# Altium project 24.WatchX2_Shellless.PrjPcb
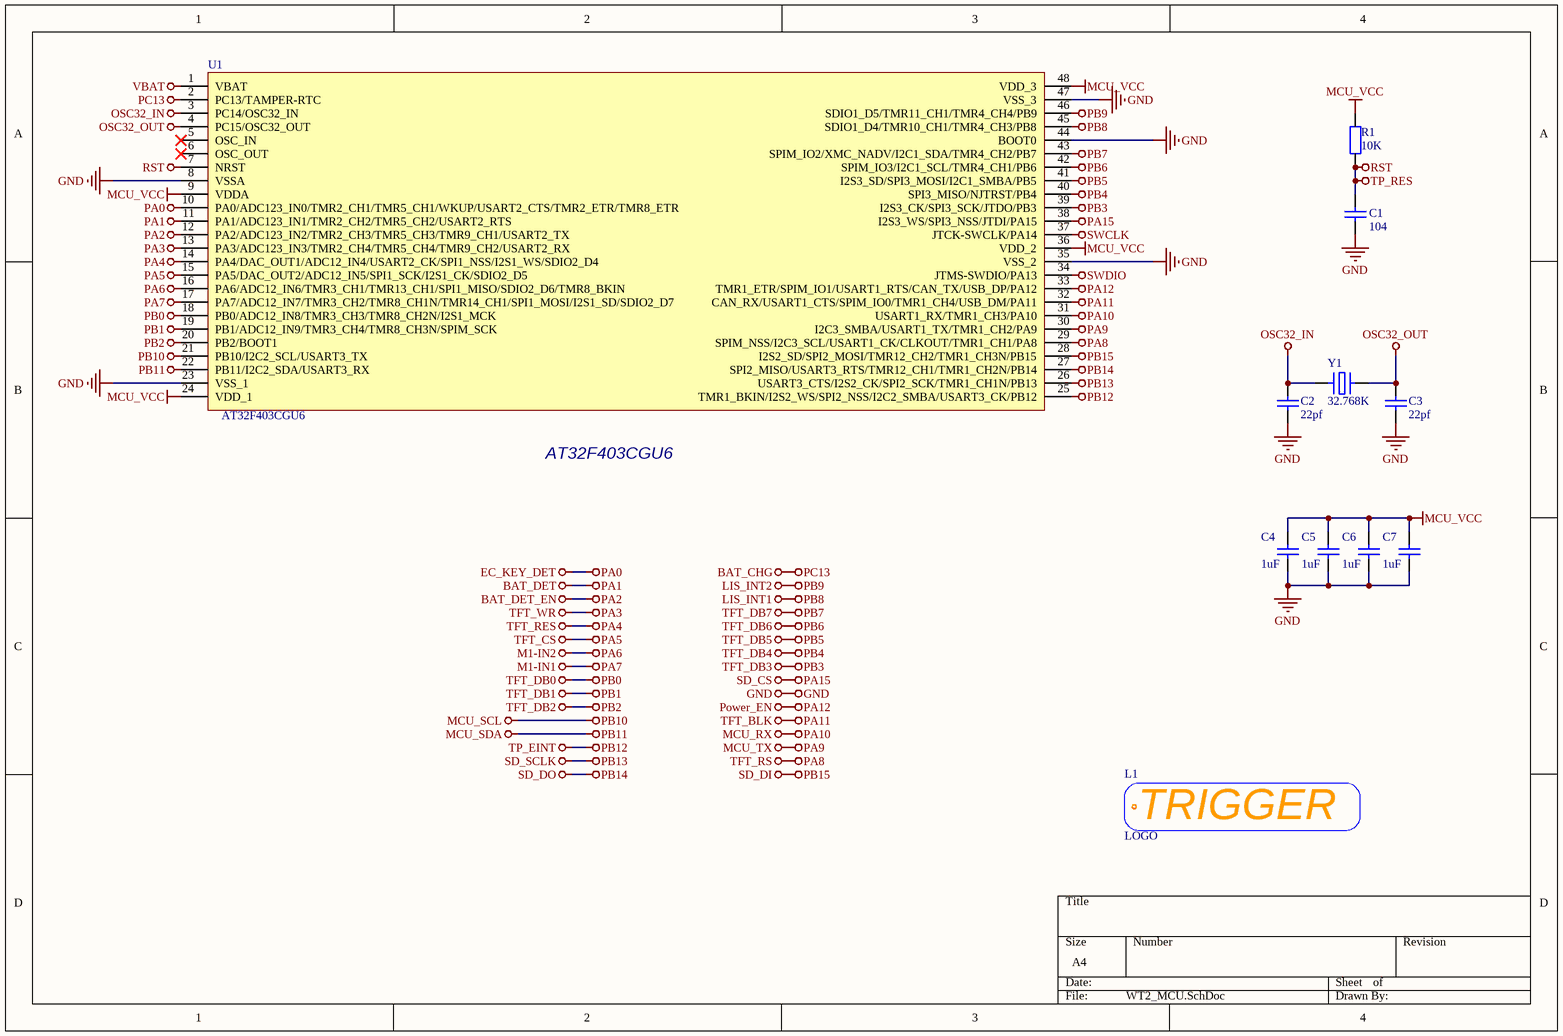
[diagram p0: WT2_MCU.SchDoc]
6 sheets, 87 parts. Net scope: global (net labels, ports and power ports of the same name join across sheets).
Board file: WT2_SL.PcbDoc
Sheets:
  WT2_MCU.SchDoc
  WT2_Ports.SchDoc
  WT2_Power.SchDoc
  WT2_Screen.SchDoc
  WT2_Sensors.SchDoc
  WT2_Slave.SchDoc

## Sheet WT2_MCU.SchDoc
size A4

### Parts
C1  104  [电容_C0402]
C2  22pf  [电容_C0402]
C3  22pf  [电容_C0402]
C4  1uF  [电容_C0402]
C5  1uF  [电容_C0402]
C6  1uF  [电容_C0402]
C7  1uF  [电容_C0402]
L1  LOGO  [LOGO REV L BS]
R1  10K  [电阻_R0402]
U1  AT32F403CGU6  [AT主控_QFN48(6X6)]
Y1  32.768K  [晶振_3215]

### Nets
BAT_CHG: U1.2(PC13/TAMPER-RTC)  [also labelled PC13]
BAT_DET: U1.11(PA1/ADC123_IN1/TMR2_CH2/TMR5_CH2/USART2_RTS)  [also labelled PA1]
BAT_DET_EN: U1.12(PA2/ADC123_IN2/TMR2_CH3/TMR5_CH3/TMR9_CH1/USART2_TX)  [also labelled PA2]
EC_KEY_DET: U1.10(PA0/ADC123_IN0/TMR2_CH1/TMR5_CH1/WKUP/USART2_CTS/TMR2_ETR/TMR8_ETR)  [also labelled PA0]
GND: C1.1 C2.2 C3.2 C4.1 C5.1 C6.1 C7.1 U1.0(VSS) U1.8(VSSA) U1.23(VSS_1) U1.35(VSS_2) U1.44(BOOT0) U1.47(VSS_3)
LIS_INT1: U1.45(SDIO1_D4/TMR10_CH1/TMR4_CH3/PB8)  [also labelled PB8]
LIS_INT2: U1.46(SDIO1_D5/TMR11_CH1/TMR4_CH4/PB9)  [also labelled PB9]
M1-IN1: U1.17(PA7/ADC12_IN7/TMR3_CH2/TMR8_CH1N/TMR14_CH1/SPI1_MOSI/I2S1_SD/SDIO2_D7)  [also labelled PA7]
M1-IN2: U1.16(PA6/ADC12_IN6/TMR3_CH1/TMR13_CH1/SPI1_MISO/SDIO2_D6/TMR8_BKIN)  [also labelled PA6]
MCU_RX: U1.31(USART1_RX/TMR1_CH3/PA10)  [also labelled PA10]
MCU_SCL: U1.21(PB10/I2C2_SCL/USART3_TX)  [also labelled PB10]  [project net ASCL]
MCU_SDA: U1.22(PB11/I2C2_SDA/USART3_RX)  [also labelled PB11]  [project net ASDA]
MCU_TX: U1.30(I2C3_SMBA/USART1_TX/TMR1_CH2/PA9)  [also labelled PA9]
MCU_VCC: C4.2 C5.2 C6.2 C7.2 R1.2 U1.9(VDDA) U1.24(VDD_1) U1.36(VDD_2) U1.48(VDD_3)  [project net 3V3]
OSC32_IN: C2.1 U1.3(PC14/OSC32_IN) Y1.1
OSC32_OUT: C3.1 U1.4(PC15/OSC32_OUT) Y1.2
PA3: U1.13(PA3/ADC123_IN3/TMR2_CH4/TMR5_CH4/TMR9_CH2/USART2_RX)  [also labelled TFT_WR]
PA4: U1.14(PA4/DAC_OUT1/ADC12_IN4/USART2_CK/SPI1_NSS/I2S1_WS/SDIO2_D4)  [also labelled TFT_RES]
PA5: U1.15(PA5/DAC_OUT2/ADC12_IN5/SPI1_SCK/I2S1_CK/SDIO2_D5)  [also labelled TFT_CS]
PA8: U1.29(SPIM_NSS/I2C3_SCL/USART1_CK/CLKOUT/TMR1_CH1/PA8)  [also labelled TFT_RS]
PA11: U1.32(CAN_RX/USART1_CTS/SPIM_IO0/TMR1_CH4/USB_DM/PA11)  [also labelled TFT_BLK]
PA12: U1.33(TMR1_ETR/SPIM_IO1/USART1_RTS/CAN_TX/USB_DP/PA12)  [also labelled Power_EN]
PB0: U1.18(PB0/ADC12_IN8/TMR3_CH3/TMR8_CH2N/I2S1_MCK)  [also labelled TFT_DB0]
PB1: U1.19(PB1/ADC12_IN9/TMR3_CH4/TMR8_CH3N/SPIM_SCK)  [also labelled TFT_DB1]
PB2: U1.20(PB2/BOOT1)  [also labelled TFT_DB2]
PB3: U1.39(I2S3_CK/SPI3_SCK/JTDO/PB3)  [also labelled TFT_DB3]
PB4: U1.40(SPI3_MISO/NJTRST/PB4)  [also labelled TFT_DB4]
PB5: U1.41(I2S3_SD/SPI3_MOSI/I2C1_SMBA/PB5)  [also labelled TFT_DB5]
PB6: U1.42(SPIM_IO3/I2C1_SCL/TMR4_CH1/PB6)  [also labelled TFT_DB6]
PB7: U1.43(SPIM_IO2/XMC_NADV/I2C1_SDA/TMR4_CH2/PB7)  [also labelled TFT_DB7]
PB12: U1.25(TMR1_BKIN/I2S2_WS/SPI2_NSS/I2C2_SMBA/USART3_CK/PB12)  [also labelled TP_EINT]
RST: C1.2 R1.1 U1.7(NRST)  [also labelled TP_RES]
SD_CS: U1.38(I2S3_WS/SPI3_NSS/JTDI/PA15)  [also labelled PA15]
SD_DI: U1.28(I2S2_SD/SPI2_MOSI/TMR12_CH2/TMR1_CH3N/PB15)  [also labelled PB15]
SD_DO: U1.27(SPI2_MISO/USART3_RTS/TMR12_CH1/TMR1_CH2N/PB14)  [also labelled PB14]
SD_SCLK: U1.26(USART3_CTS/I2S2_CK/SPI2_SCK/TMR1_CH1N/PB13)  [also labelled PB13]
SWCLK: U1.37(JTCK-SWCLK/PA14)
SWDIO: U1.34(JTMS-SWDIO/PA13)
VBAT: U1.1(VBAT)

Not connected (* = marked no-connect by the designer): U1 5(OSC_IN)* 6(OSC_OUT)*

### Notes on the sheet
- (near U1) AT32F403CGU6
- (in symbol LOGO_TRIGGER) TRIGGER

### Library data of the parts
C1-C7 = cap: U: 50V; 参数: Cap,0805,X7R,104K,50V,125C,±10%
  C1: C: 104
  C2 C3: C: 22pf
  C4-C7: C: 1uF
L1 = LOGO_TRIGGER
R1 = Res: P: 1/8W; 参数: Res,0805,0R,±1%,1/8W,100ppm,155C; R: 10K
U1 = AT32F403CGU6: _Footprint: QFN48; _Comma: ,; _Name: MCU; _Specification: MCU,AT32F403CGU6,QFN48; _Model: AT32F403CGU6
Y1 = XTAL_A: _Name: CRYSTALS; _Comma: ,; _Specification: CRYSTALS,32.768K,*,10ppm,12pF; _Accuracy: 10ppm; _CL: 12pF; _Footprint: *; _Frequency: 32.768K

## Sheet WT2_Ports.SchDoc
size A4
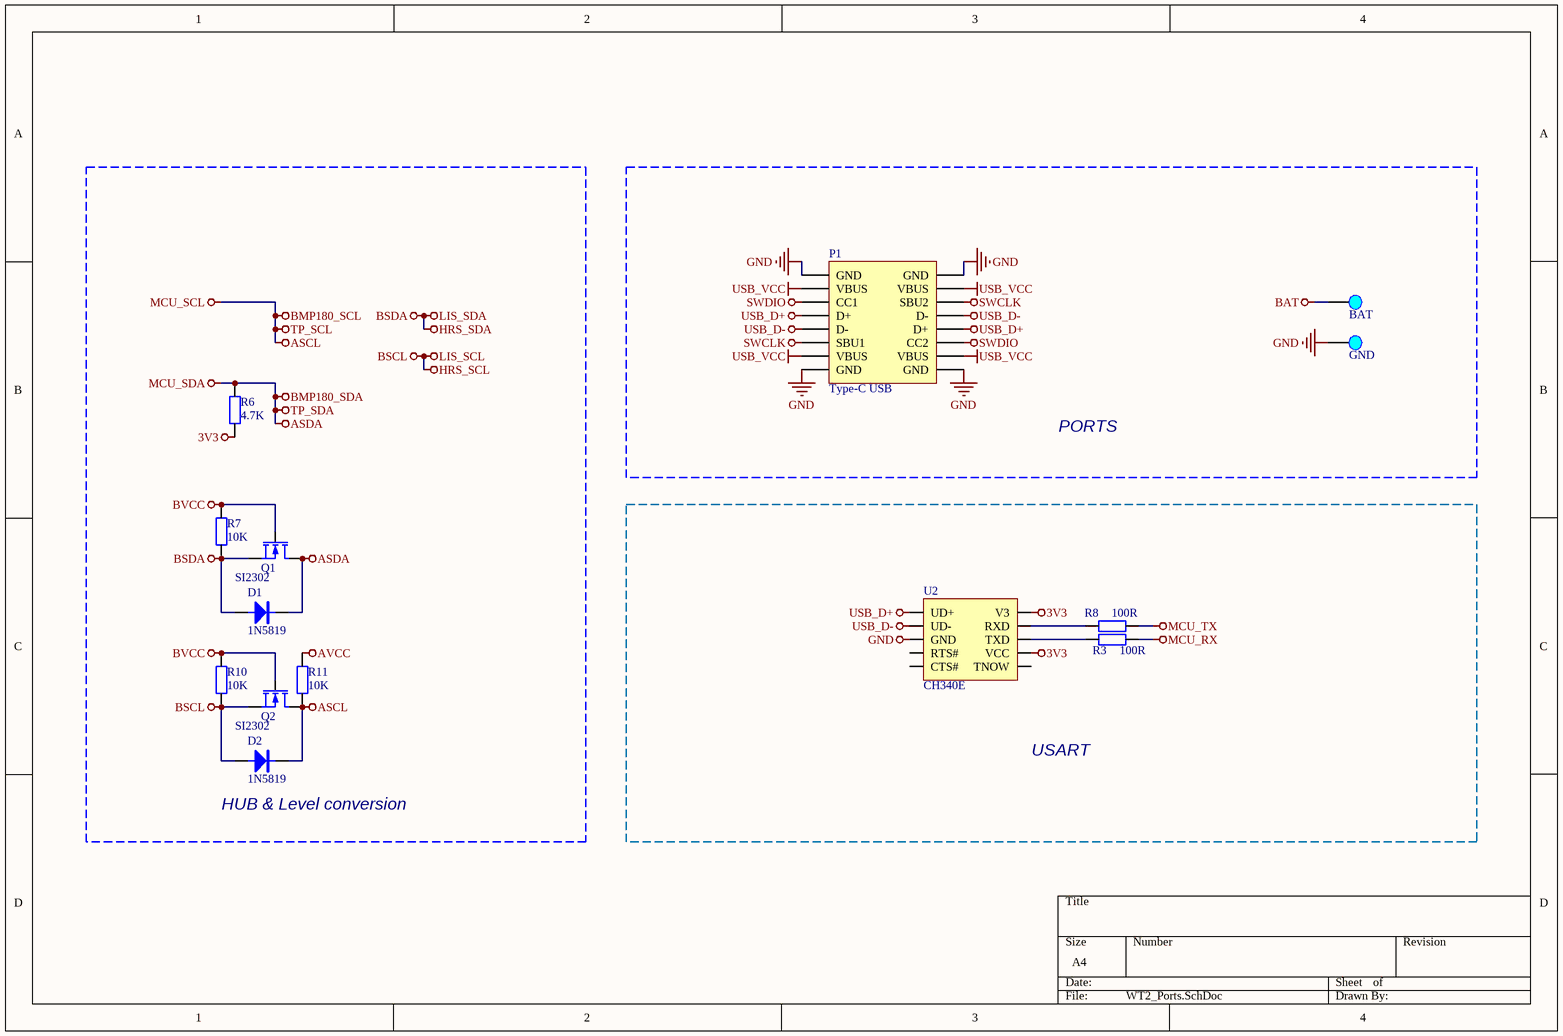
[diagram p1: WT2_Ports.SchDoc]

### Parts
D1  1N5819  [二极管_SOD-323]
D2  1N5819  [二极管_SOD-323]
P1  Type-C USB  [Type-C_16P]
Pad2  BAT  [Pad_A]
Pad4  GND  [Pad_A]
Q1  SI2302  [MOS_SOT-23]
Q2  SI2302  [MOS_SOT-23]
R3  100R  [电阻_R0402]
R6  4.7K  [电阻_R0402]
R7  10K  [电阻_R0402]
R8  100R  [电阻_R0402]
R10  10K  [电阻_R0402]
R11  10K  [电阻_R0402]
U2  CH340E  [MSOP10]

### Blocks framed on the sheet
HUB & Level conversion: D1 D2 Q1 Q2 R6 R7 R10 R11
PORTS: P1 Pad2 Pad4
USART: R3 R8 U2

### Nets
3V3: R6.1 R11.1 U2.7(VCC) U2.10(V3)  [also labelled AVCC]
ASCL: D2.K Q2.2(D) R11.2  [also labelled BMP180_SCL, MCU_SCL, TP_SCL]
ASDA: D1.K Q1.2(D) R6.2  [also labelled BMP180_SDA, MCU_SDA, TP_SDA]
BAT: Pad2.1
BSCL: D2.A Q2.3(S) R10.2  [also labelled HRS_SCL, LIS_SCL]
BSDA: D1.A Q1.3(S) R7.2  [also labelled HRS_SDA, LIS_SDA]
BVCC: Q1.1(G) Q2.1(G) R7.1 R10.1  [project net 1.8V]
GND: P1.0(GND) P1.A1(GND) P1.A12(GND) P1.B1(GND) P1.B12(GND) Pad4.1 U2.3(GND)
MCU_RX: R3.1
MCU_TX: R8.1
SWCLK: P1.A8(SBU1) P1.B8(SBU2)
SWDIO: P1.A5(CC1) P1.B5(CC2)
USB_D+: P1.A6(D+) P1.B6(D+) U2.1(UD+)
USB_D-: P1.A7(D-) P1.B7(D-) U2.2(UD-)
USB_VCC: P1.A4(VBUS) P1.A9(VBUS) P1.B4(VBUS) P1.B9(VBUS)
NetR3_2: R3.2 U2.8(TXD)
NetR8_2: R8.2 U2.9(RXD)

Not connected (* = marked no-connect by the designer): U2 4(RTS#) 5(CTS#) 6(TNOW)

### Library data of the parts
D1 D2 = Diode: _Specification: Diode,1N5819,SOD-323,1A,40V; _Comma: ,; _Footprint: SOD-323; _Voltage: 40V; _Current: 1A; _Name: Diode; _Model: 1N5819
P1 = Type-C USB Easy 16PIN: _Comma: ,; _Name: Port; _Specification: Port,Type-C USB,16PIN; _Value: 16PIN; _Model: Type-C USB
Pad2 = Pad: _Funcyusa: Test; _Specification: Pad,Test,BAT; _Comma: ,; _Name: Pad; _Remarks: BAT
Pad4 = Pad: _Funcyusa: Test; _Specification: Pad,Test,GND; _Comma: ,; _Name: Pad; _Remarks: GND
Q1 Q2 = MOSFET-N: _Comma: ,; _Current: 150A; _Footprint: DFN5*6; _Name: N-MOSFET; _Specification: N-MOSFET,SI2302,DFN5*6,150A,30V; _Voltage: 30V; _Model: SI2302
R3 R6-R8 R10 R11 = Res: as R1 on sheet WT2_MCU
  R3 R8: R: 100R
  R6: R: 4.7K
  R7 R10 R11: R: 10K

## Sheet WT2_Power.SchDoc
size A4
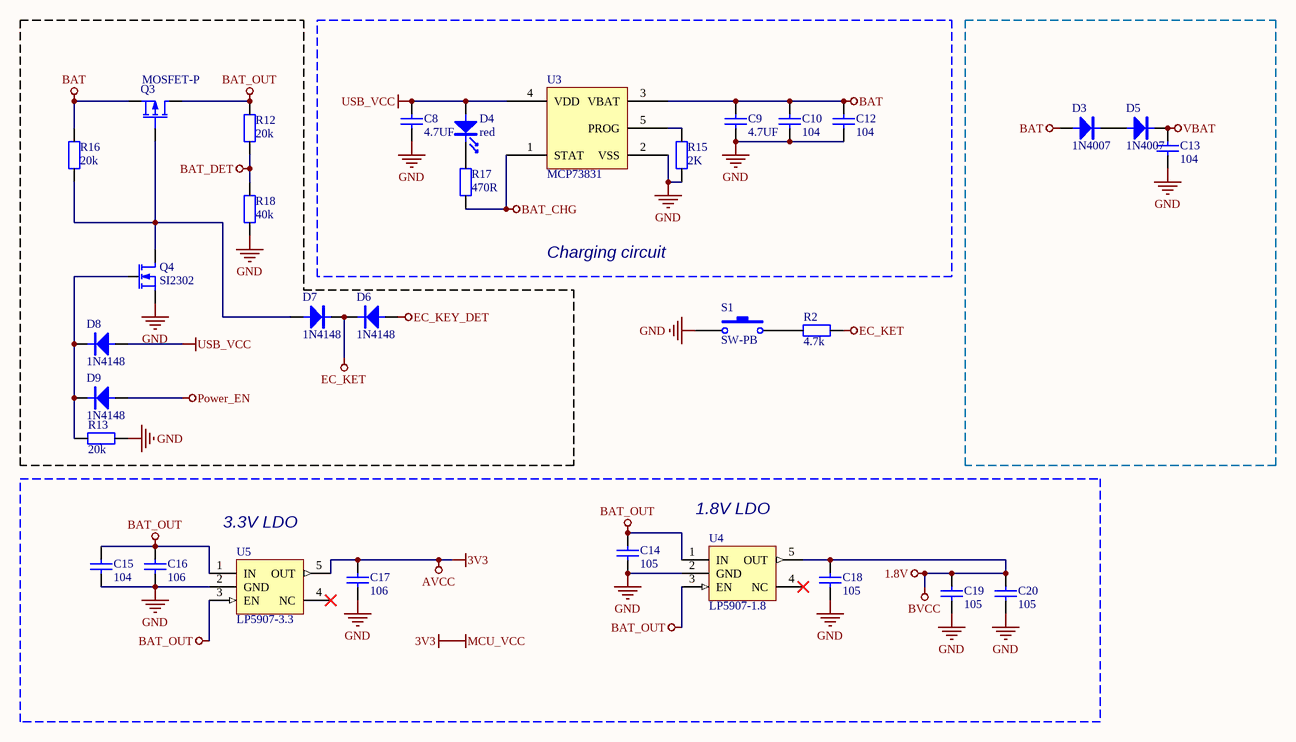
[diagram p2: WT2_Power.SchDoc]

### Parts
(Parts that share a designator on the sheet are numbered #1, #2 ... from top to bottom, then left to right.)
C8  4.7UF  [电容_C0805]
C9  4.7UF  [电容_C0805]
C10  104  [电容_C0402]
C12  104  [电容_C0402]
C13  104  [电容_C0402]
C14  105  [电容_C0402]
C15  104  [电容_C0402]
C16  106  [电容_C0603]
C17  106  [电容_C0603]
C18  105  [电容_C0402]
C19  105  [电容_C0402]
C20  105  [电容_C0402]
D3  1N4007  [二极管_SOD-323]
D4  red  [LED_0603]
D5  1N4007  [二极管_SOD-323]
D6  1N4148  [二极管_SOD-323]
D7  1N4148  [二极管_SOD-323]
D8  1N4148  [二极管_SOD-323]
D9  1N4148  [二极管_SOD-323]
Q3  MOSFET-P  [SOT23]
Q4#1  SI2302  [MOS_SOT-23]
R2  4.7k  [电阻_R0402]
R12  20k  [电阻_R0402]
R13  20k  [电阻_R0402]
R15  2K  [电阻_R0402]
R16  20k  [电阻_R0402]
R17  470R  [电阻_R0402]
R18  40k  [电阻_R0402]
S1  SW-PB  [KEY-TE26EA]
U3  MCP73831  [SOT23-5]
U4  LP5907-1.8  [SOT23-5]
U5  LP5907-3.3  [SOT23-5]

### Blocks framed on the sheet
Charging circuit: C8-C10 C12 D4 R15 R17 U3

### Nets
1.8V: C18.2 C19.2 C20.2 U4.5(OUT)  [also labelled BVCC]
3V3: C17.2 U5.5(OUT)  [also labelled AVCC, MCU_VCC]
BAT: C9.2 C10.1 C12.1 D3.A Q3.3(S) R16.2 U3.3(VBAT)
BAT_CHG: R17.1 U3.1(STAT)
BAT_DET: R12.1 R18.2
BAT_OUT: C14.2 C15.2 C16.2 Q3.2(D) R12.2 U4.1(IN) U4.3(EN) U5.1(IN) U5.3(EN)
EC_KET: D6.K D7.K R2.1
EC_KEY_DET: D6.A
GND: C8.1 C9.1 C10.2 C12.2 C13.2 C14.1 C15.1 C16.1 C17.1 C18.1 C19.1 C20.1 Q4#1.3(S) R13.1 R15.1 R18.1 S1.1 U3.2(VSS) U4.2(GND) U5.2(GND)
Power_EN: D9.A  [project net PA12]
USB_VCC: C8.2 D4.A D8.A U3.4(VDD)
VBAT: C13.1 D5.K
NetD3_K: D3.K D5.A
NetD4_K: D4.K R17.2
NetD7_A: D7.A Q3.1(G) Q4#1.2(D) R16.1
NetD8_K: D8.K D9.K Q4#1.1(G) R13.2
NetR2_2: R2.2 S1.2
NetR15_2: R15.2 U3.5(PROG)

Not connected (* = marked no-connect by the designer): U4 4(NC)*; U5 4(NC)*

### Notes on the sheet
- (near U5) 3.3V LDO
- (near U4) 1.8V LDO

### Library data of the parts
C8-C10 C12-C20 = cap: as C1 on sheet WT2_MCU
  C8 C9: C: 4.7UF
  C10 C12 C13 C15: C: 104
  C14 C18-C20: C: 105
  C16 C17: C: 106
D3 D5 = Diode: _Specification: Diode,1N4007,SOD-323,1A,40V; _Comma: ,; _Footprint: SOD-323; _Voltage: 40V; _Current: 1A; _Name: Diode; _Model: 1N4007
D4 = LED: 参数: LED,0603,Red
D6-D9 = Diode: _Specification: Diode,1N4148,SOD-323,1A,40V; _Comma: ,; _Footprint: SOD-323; _Voltage: 40V; _Current: 1A; _Name: Diode; _Model: 1N4148
Q3 = MOSFET-P: P-Channel MOSFET; Published: 8-Jun-2000; LatestRevisionDate: 17-Jul-2002; LatestRevisionNote: Re-released for DXP Platform.; PackageVersion: 1995/1996; PackageReference: E3; Publisher: Altium Limited; PackageDescription: TO, Flat Index; 3 In-Line, Axial Leads; Body Dia. 4.6mm; Lead Dia. 0.5 mm (max)
Q4#1 = MOSFET-N: as Q1 on sheet WT2_Ports; _Model: SI2302
R2 R12 R13 R15-R18 = Res: as R1 on sheet WT2_MCU
  R2: R: 4.7k
  R12 R13 R16: R: 20k
  R15: R: 2K
  R17: R: 470R
  R18: R: 40k
S1 = SW-PB: 按键
U3 = MCP73831: 线性充电管理控制器
U4 U5 = LP5907: LDO

## Sheet WT2_Screen.SchDoc
size A4
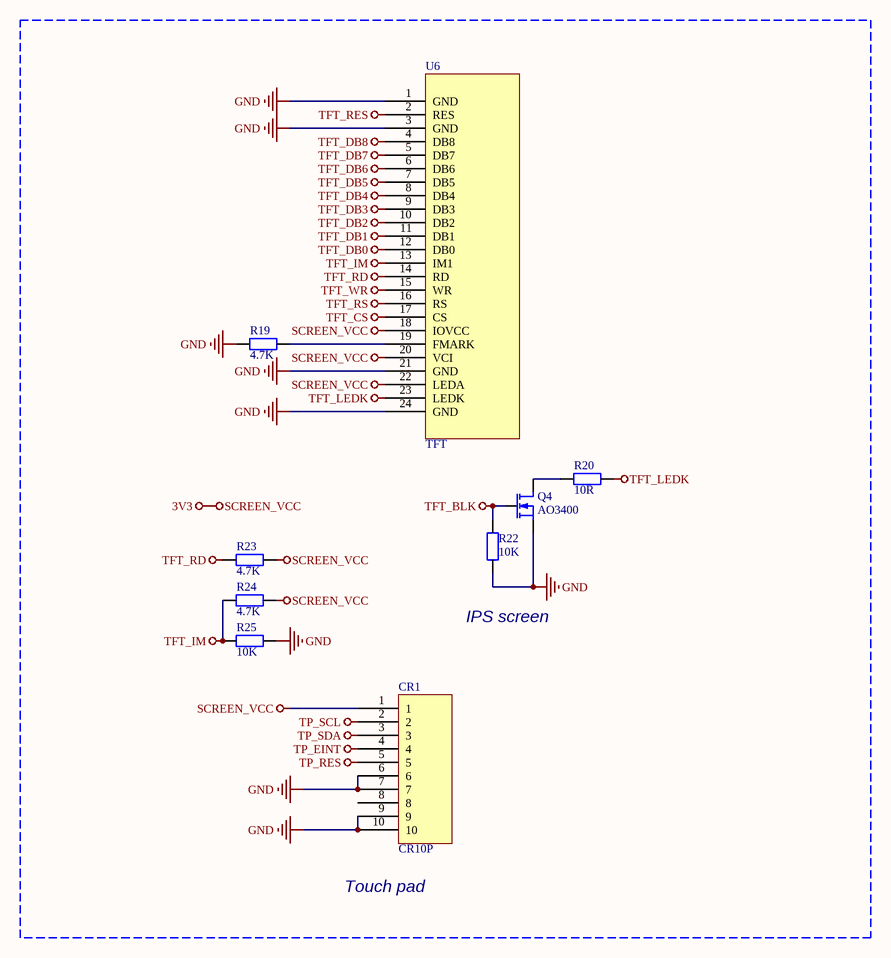
[diagram p3: WT2_Screen.SchDoc]

### Parts
(Parts that share a designator on the sheet are numbered #1, #2 ... from top to bottom, then left to right.)
CR1  CR10P  [CONN RCPT 10POS 0.4MM]
Q4#2  AO3400  [MOS_SOT-23]
R19  4.7K  [电阻_R0402]
R20  10R  [电阻_R0402]
R22  10K  [电阻_R0402]
R23  4.7K  [电阻_R0402]
R24  4.7K  [电阻_R0402]
R25  10K  [电阻_R0402]
U6  TFT  [CONN-SMD_DF37NC-24DS-0.4V(51)]

### Nets
3V3: CR1.1 R23.2 R24.2 U6.18(IOVCC) U6.20(VCI) U6.22(LEDA)  [also labelled SCREEN_VCC]
GND: CR1.6 CR1.7 CR1.9 CR1.10 Q4#2.3(S) R19.1 R22.1 R25.1 U6.1(GND) U6.3(GND) U6.21(GND) U6.24(GND)
TFT_BLK: Q4#2.1(G) R22.2  [project net PA11]
TFT_CS: U6.17(CS)  [project net PA5]
TFT_DB0: U6.12(DB0)  [project net PB0]
TFT_DB1: U6.11(DB1)  [project net PB1]
TFT_DB2: U6.10(DB2)  [project net PB2]
TFT_DB3: U6.9(DB3)  [project net PB3]
TFT_DB4: U6.8(DB4)  [project net PB4]
TFT_DB5: U6.7(DB5)  [project net PB5]
TFT_DB6: U6.6(DB6)  [project net PB6]
TFT_DB7: U6.5(DB7)  [project net PB7]
TFT_DB8: U6.4(DB8)
TFT_IM: R24.1 R25.2 U6.13(IM1)
TFT_LEDK: R20.2 U6.23(LEDK)
TFT_RD: R23.1 U6.14(RD)
TFT_RES: U6.2(RES)  [project net PA4]
TFT_RS: U6.16(RS)  [project net PA8]
TFT_WR: U6.15(WR)  [project net PA3]
TP_EINT: CR1.4  [project net PB12]
TP_RES: CR1.5  [project net RST]
TP_SCL: CR1.2  [project net ASCL]
TP_SDA: CR1.3  [project net ASDA]
NetQ4#2_2: Q4#2.2(D) R20.1
NetR19_2: R19.2 U6.19(FMARK)

Not connected (* = marked no-connect by the designer): CR1 8

### Notes on the sheet
- (near R22) IPS screen
- (near CR1) Touch pad

### Library data of the parts
CR1 = CONN RCPT 10P: 板对板连接器
Q4#2 = MOSFET-N: _Comma: ,; _Current: 150A; _Footprint: DFN5*6; _Name: N-MOSFET; _Specification: N-MOSFET,AO3400,DFN5*6,150A,30V; _Voltage: 30V; _Model: AO3400
R19 R23 R24 = Res: _Accuracy: 1%; _Power: 1/8W; _Footprint: 0805; _Drift: 100ppm; _Comma: ,; _Specification: Res,0805,4.7K,1%,1/8W,100ppm; _Name: Res; _Value: 4.7K
R20 = Res: _Accuracy: 1%; _Power: 1/8W; _Footprint: 0805; _Drift: 100ppm; _Comma: ,; _Specification: Res,0805,10R,1%,1/8W,100ppm; _Name: Res; _Value: 10R
R22 R25 = Res: _Accuracy: 1%; _Power: 1/8W; _Footprint: 0805; _Drift: 100ppm; _Comma: ,; _Specification: Res,0805,10K,1%,1/8W,100ppm; _Name: Res; _Value: 10K
U6 = TFT_IPS_8Bit_1.54_240*240

## Sheet WT2_Sensors.SchDoc
size A4
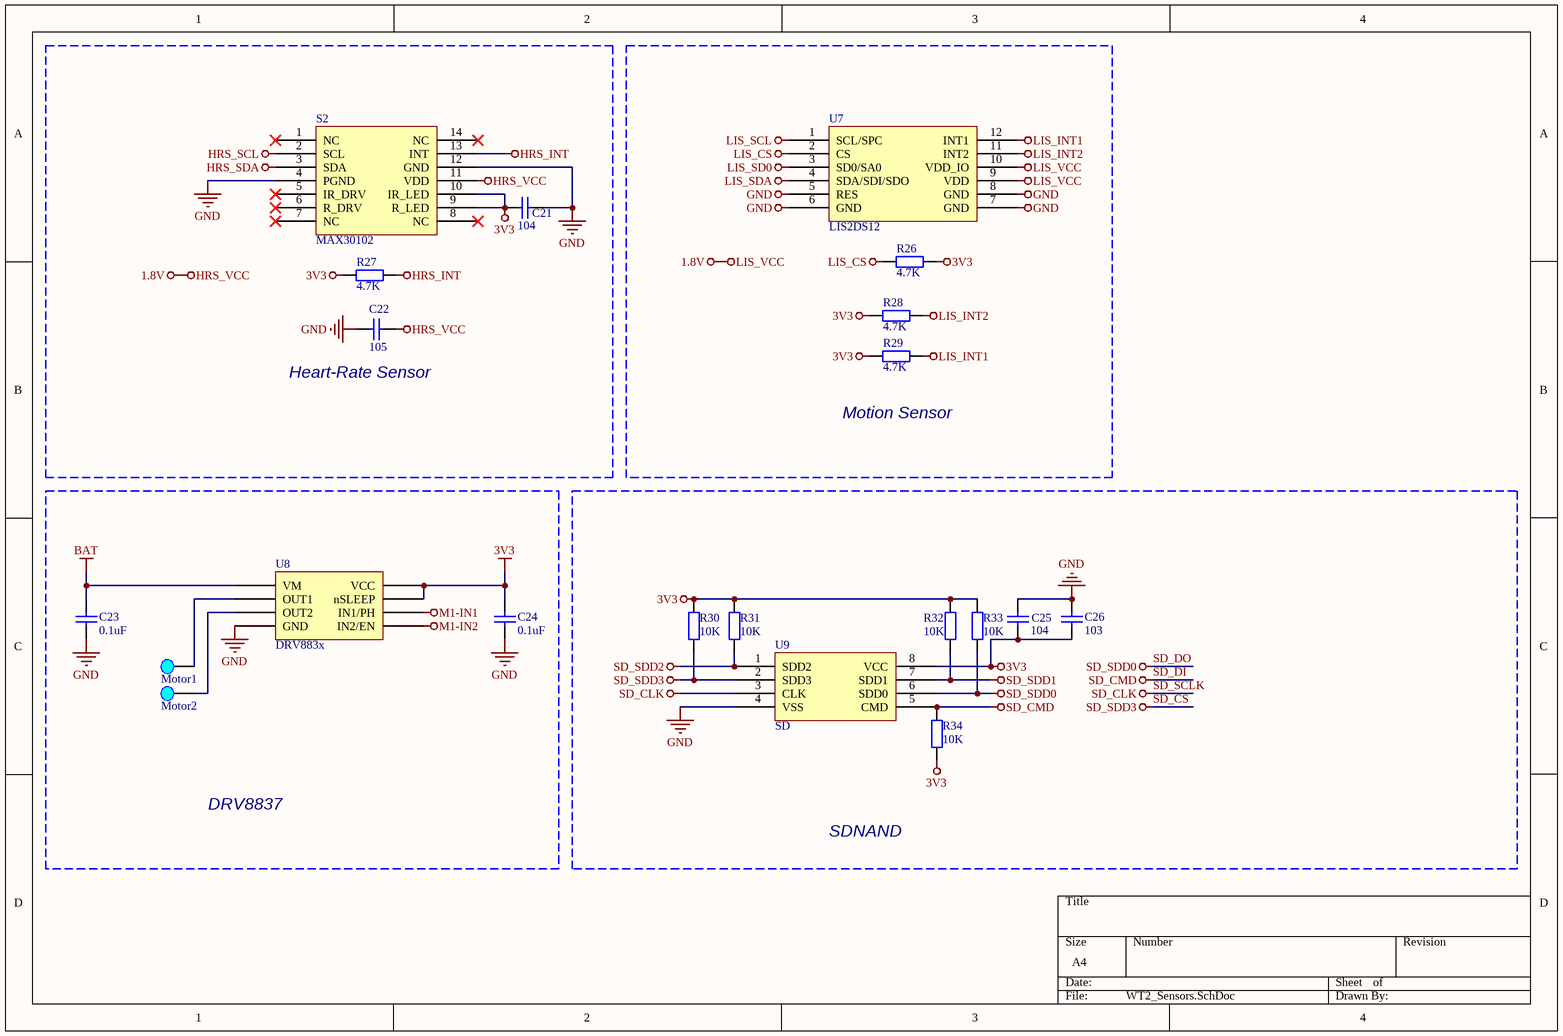
[diagram p4: WT2_Sensors.SchDoc]

### Parts
C21  104  [电容_C0402]
C22  105  [电容_C0402]
C23  0.1uF  [电容_C0402]
C24  0.1uF  [电容_C0402]
C25  104  [电容_C0402]
C26  103  [电容_C0402]
Pad7  Motor1  [Pad_A]
Pad8  Motor2  [Pad_A]
R26  4.7K  [电阻_R0402]
R27  4.7K  [电阻_R0402]
R28  4.7K  [电阻_R0402]
R29  4.7K  [电阻_R0402]
R30  10K  [电阻_R0402]
R31  10K  [电阻_R0402]
R32  10K  [电阻_R0402]
R33  10K  [电阻_R0402]
R34  10K  [电阻_R0402]
S2  MAX30102  [MAX30102]
U7  LIS2DS12  [LGA-12_2*2mm]
U8  DRV883x  [WSON-8_2*2]
U9  SD  [LGA-8_6*8mm2]

### Blocks framed on the sheet
Heart-Rate Sensor: C21 C22 R27 S2
Motion Sensor: R26 R28 R29 U7
DRV8837: C23 C24 Pad7 Pad8 U8
SDNAND: C25 C26 R30-R34 U9

### Nets
1.8V: C22.1 S2.11(VDD) U7.9(VDD) U7.10(VDD_IO)  [also labelled HRS_VCC, LIS_VCC]
3V3: C21.2 C24.2 C25.1 C26.1 R26.1 R27.2 R28.2 R29.2 R30.1 R31.1 R32.1 R33.1 R34.2 S2.9(R_LED) S2.10(IR_LED) U8.7(nSLEEP) U8.8(VCC) U9.8(VCC)
BAT: C23.1 U8.1(VM)
GND: C21.1 C22.2 C23.2 C24.1 C25.2 C26.2 S2.4(PGND) S2.12(GND) U7.5(RES) U7.6(GND) U7.7(GND) U7.8(GND) U8.4(GND) U9.4(VSS)
HRS_INT: R27.1 S2.13(INT)
HRS_SCL: S2.2(SCL) U7.1(SCL/SPC)  [also labelled LIS_SCL]  [project net BSCL]
HRS_SDA: S2.3(SDA) U7.4(SDA/SDI/SDO)  [also labelled LIS_SDA]  [project net BSDA]
LIS_CS: R26.2 U7.2(CS)
LIS_INT1: R29.1 U7.12(INT1)
LIS_INT2: R28.1 U7.11(INT2)
LIS_SD0: U7.3(SD0/SA0)
M1-IN1: U8.6(IN1/PH)
M1-IN2: U8.5(IN2/EN)
SD_CS: R30.2 U9.2(SDD3)  [also labelled SD_SDD3]
SD_DI: R34.1 U9.5(CMD)  [also labelled SD_CMD]
SD_DO: R33.2 U9.6(SDD0)  [also labelled SD_SDD0]
SD_SCLK: U9.3(CLK)  [also labelled SD_CLK]
SD_SDD1: R32.2 U9.7(SDD1)
SD_SDD2: R31.2 U9.1(SDD2)
NetPad7_1: Pad7.1 U8.2(OUT1)
NetPad8_1: Pad8.1 U8.3(OUT2)

Not connected (* = marked no-connect by the designer): S2 1(NC)* 5(IR_DRV)* 6(R_DRV)* 7(NC)* 8(NC)* 14(NC)*

### Library data of the parts
C21-C26 = cap: as C1 on sheet WT2_MCU
  C21 C25: C: 104
  C22: C: 105
  C23 C24: C: 0.1uF
  C26: C: 103
Pad7 = Pad: _Funcyusa: Test; _Specification: Pad,Test,Motor1; _Comma: ,; _Name: Pad; _Remarks: Motor1
Pad8 = Pad: _Funcyusa: Test; _Specification: Pad,Test,Motor2; _Comma: ,; _Name: Pad; _Remarks: Motor2
R26-R34 = Res: as R1 on sheet WT2_MCU
  R26-R29: R: 4.7K
  R30-R34: R: 10K
S2 = MAX30102: 血氧浓度传感器
U7 = LIS2DS12: 运动传感器
U9 = SDNAND

## Sheet WT2_Slave.SchDoc
size A4

## Nets that join several sheets
1.8V: WT2_Ports (Q1.1 Q2.1 R7.1 R10.1), WT2_Power (C18.2 C19.2 C20.2 U4.5), WT2_Sensors (C22.1 S2.11 U7.9 U7.10)
3V3: WT2_MCU (9 pins), WT2_Ports (R6.1 R11.1 U2.7 U2.10), WT2_Power (C17.2 U5.5), WT2_Screen (6 pins), WT2_Sensors (18 pins)
ASCL: WT2_MCU (U1.21), WT2_Ports (D2.K Q2.2 R11.2), WT2_Screen (CR1.2)
ASDA: WT2_MCU (U1.22), WT2_Ports (D1.K Q1.2 R6.2), WT2_Screen (CR1.3)
BAT: WT2_Ports (Pad2.1), WT2_Power (7 pins), WT2_Sensors (C23.1 U8.1)
BAT_CHG: WT2_MCU (U1.2), WT2_Power (R17.1 U3.1)
BAT_DET: WT2_MCU (U1.11), WT2_Power (R12.1 R18.2)
BSCL: WT2_Ports (D2.A Q2.3 R10.2), WT2_Sensors (S2.2 U7.1)
BSDA: WT2_Ports (D1.A Q1.3 R7.2), WT2_Sensors (S2.3 U7.4)
EC_KEY_DET: WT2_MCU (U1.10), WT2_Power (D6.A)
GND: WT2_MCU (13 pins), WT2_Ports (7 pins), WT2_Power (20 pins), WT2_Screen (12 pins), WT2_Sensors (14 pins)
LIS_INT1: WT2_MCU (U1.45), WT2_Sensors (R29.1 U7.12)
LIS_INT2: WT2_MCU (U1.46), WT2_Sensors (R28.1 U7.11)
M1-IN1: WT2_MCU (U1.17), WT2_Sensors (U8.6)
M1-IN2: WT2_MCU (U1.16), WT2_Sensors (U8.5)
MCU_RX: WT2_MCU (U1.31), WT2_Ports (R3.1)
MCU_TX: WT2_MCU (U1.30), WT2_Ports (R8.1)
PA3: WT2_MCU (U1.13), WT2_Screen (U6.15)
PA4: WT2_MCU (U1.14), WT2_Screen (U6.2)
PA5: WT2_MCU (U1.15), WT2_Screen (U6.17)
PA8: WT2_MCU (U1.29), WT2_Screen (U6.16)
PA11: WT2_MCU (U1.32), WT2_Screen (Q4#2.1 R22.2)
PA12: WT2_MCU (U1.33), WT2_Power (D9.A)
PB0: WT2_MCU (U1.18), WT2_Screen (U6.12)
PB1: WT2_MCU (U1.19), WT2_Screen (U6.11)
PB2: WT2_MCU (U1.20), WT2_Screen (U6.10)
PB3: WT2_MCU (U1.39), WT2_Screen (U6.9)
PB4: WT2_MCU (U1.40), WT2_Screen (U6.8)
PB5: WT2_MCU (U1.41), WT2_Screen (U6.7)
PB6: WT2_MCU (U1.42), WT2_Screen (U6.6)
PB7: WT2_MCU (U1.43), WT2_Screen (U6.5)
PB12: WT2_MCU (U1.25), WT2_Screen (CR1.4)
RST: WT2_MCU (C1.2 R1.1 U1.7), WT2_Screen (CR1.5)
SD_CS: WT2_MCU (U1.38), WT2_Sensors (R30.2 U9.2)
SD_DI: WT2_MCU (U1.28), WT2_Sensors (R34.1 U9.5)
SD_DO: WT2_MCU (U1.27), WT2_Sensors (R33.2 U9.6)
SD_SCLK: WT2_MCU (U1.26), WT2_Sensors (U9.3)
SWCLK: WT2_MCU (U1.37), WT2_Ports (P1.A8 P1.B8)
SWDIO: WT2_MCU (U1.34), WT2_Ports (P1.A5 P1.B5)
USB_VCC: WT2_Ports (P1.A4 P1.A9 P1.B4 P1.B9), WT2_Power (C8.2 D4.A D8.A U3.4)
VBAT: WT2_MCU (U1.1), WT2_Power (C13.1 D5.K)